# Altium schematic sheet BancoPrueba.SchDoc
size A4
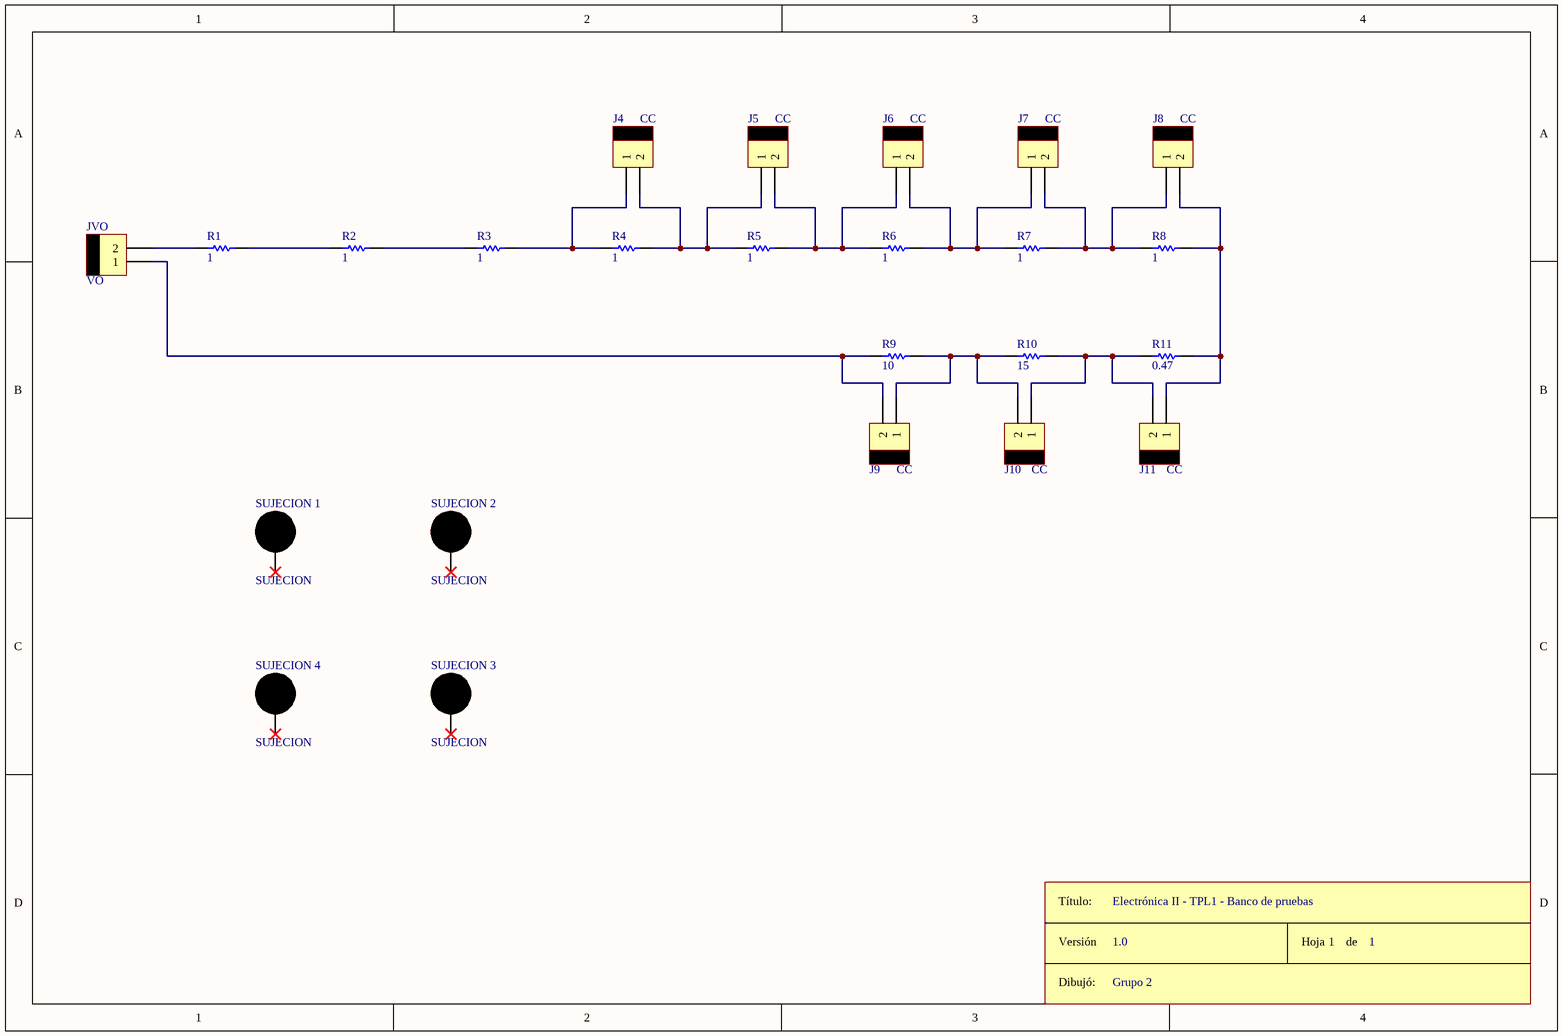
[diagram p0: BancoPrueba.SchDoc]

## Parts
J4  CC  [MOLEX2]
J5  CC  [MOLEX2]
J6  CC  [MOLEX2]
J7  CC  [MOLEX2]
J8  CC  [MOLEX2]
J9  CC  [MOLEX2]
J10  CC  [MOLEX2]
J11  CC  [MOLEX2]
JVO  VO  [MOLEX2]
R1  1  [RES600]
R2  1  [RES600]
R3  1  [RES600]
R4  1  [RES600]
R5  1  [RES600]
R6  1  [RES600]
R7  1  [RES600]
R8  1  [RES600]
R9  10  [RES1200]
R10  15  [RES600]
R11  0.47  [RES600]
ROT1  Rótulo  (value not drawn)
SUJECION_1  SUJECION  [SUJECION (5.00MM - 3.50MM)]
SUJECION_2  SUJECION  [SUJECION (5.00MM - 3.50MM)]
SUJECION_3  SUJECION  [SUJECION (5.00MM - 3.50MM)]
SUJECION_4  SUJECION  [SUJECION (5.00MM - 3.50MM)]

## Nets
NetJ4_1: J4.1 R3.2 R4.1
NetJ4_2: J4.2 J5.1 R4.2 R5.1
NetJ5_2: J5.2 J6.1 R5.2 R6.1
NetJ6_2: J6.2 J7.1 R6.2 R7.1
NetJ7_2: J7.2 J8.1 R7.2 R8.1
NetJ8_2: J8.2 J11.1 R8.2 R11.2
NetJ9_1: J9.1 J10.2 R9.2 R10.1
NetJ9_2: J9.2 JVO.1 R9.1
NetJ10_1: J10.1 J11.2 R10.2 R11.1
NetJVO_2: JVO.2 R1.1
NetR1_2: R1.2 R2.1
NetR2_2: R2.2 R3.1

Not connected (* = marked no-connect by the designer): SUJECION_1 1*; SUJECION_2 1*; SUJECION_3 1*; SUJECION_4 1*

## Notes on the sheet
- Electrónica II - TPL1 - Banco de pruebas
- 1.0
- Grupo 2
- 1
- (in symbol Rótulo) Título:; Versión; Hoja       de; Dibujó:

## Library data of the parts
J4-J11 JVO = MOLEX2
R1-R11 = RES